# Altium schematic sheet Buck_Converter.SchDoc
size A4
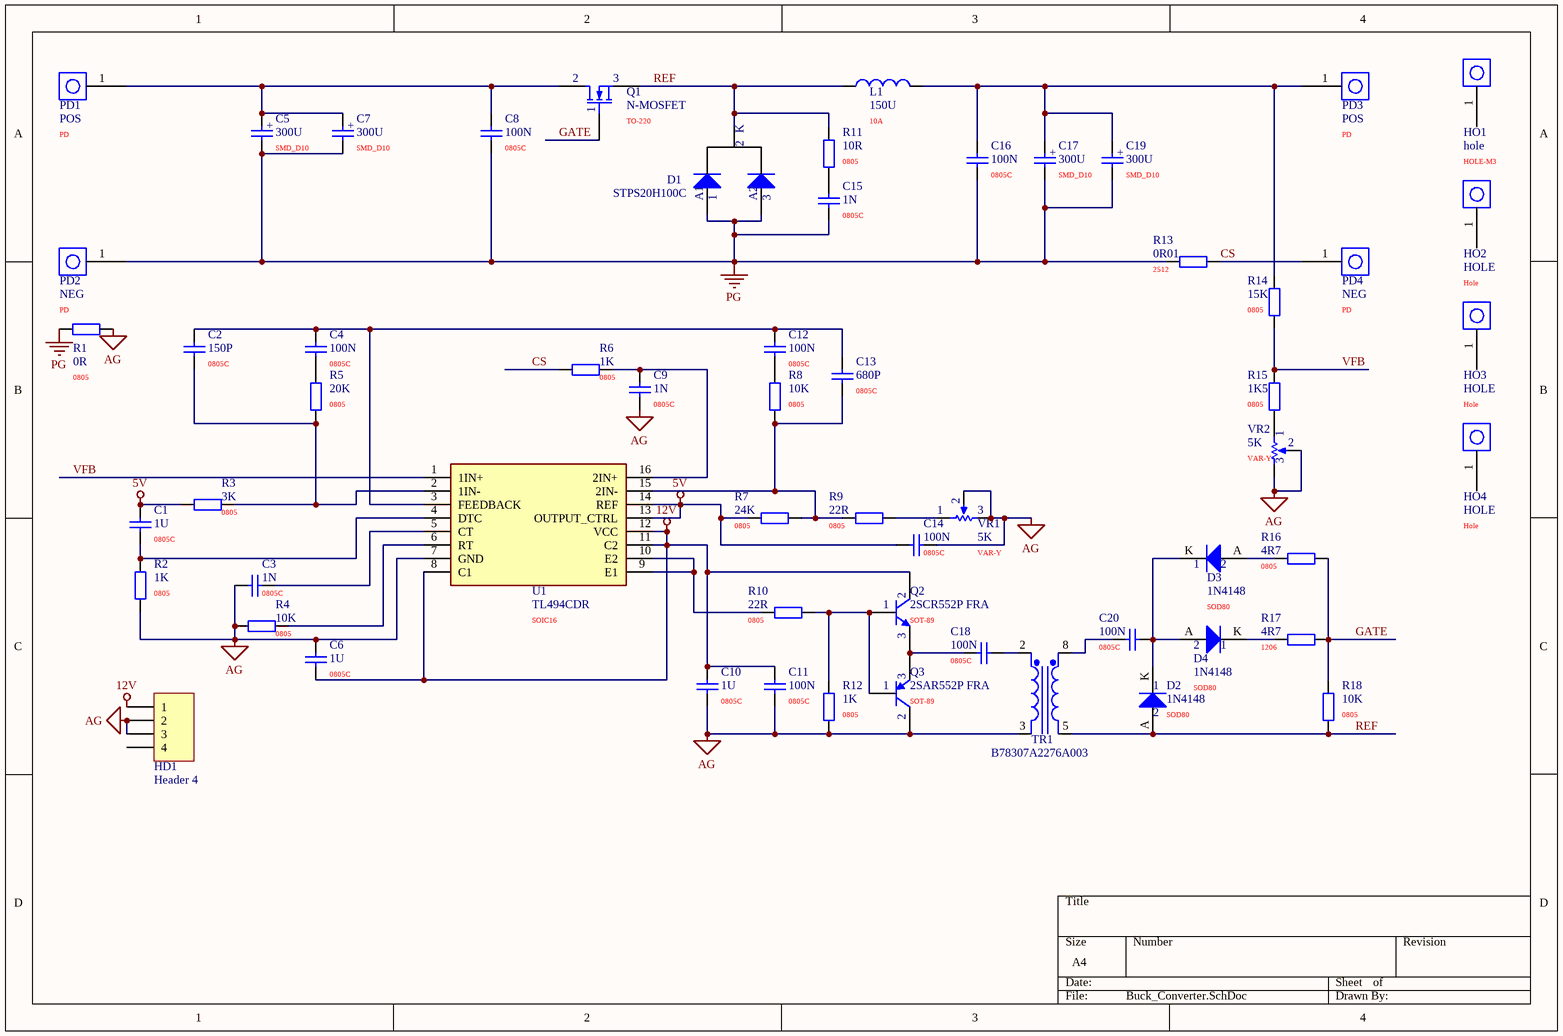
[diagram p0: Buck_Converter.SchDoc]

## Parts
C1  1uF  [Capacitors_SMD_0805]  (value not drawn)
C2  150pF  [Capacitors_SMD_0805]  (value not drawn)
C3  1nF  [Capacitors_SMD_0805]  (value not drawn)
C4  100nF  [Capacitors_SMD_0805]  (value not drawn)
C5  330uf  [Capacitors_SMD_D10]  (value not drawn)
C6  1uF  [Capacitors_SMD_0805]  (value not drawn)
C7  330uf  [Capacitors_SMD_D10]  (value not drawn)
C8  100nF  [Capacitors_SMD_0805]  (value not drawn)
C9  1nF  [Capacitors_SMD_0805]  (value not drawn)
C10  1uF  [Capacitors_SMD_0805]  (value not drawn)
C11  100nF  [Capacitors_SMD_0805]  (value not drawn)
C12  100nF  [Capacitors_SMD_0805]  (value not drawn)
C13  680pF  [Capacitors_SMD_0805]  (value not drawn)
C14  100nF  [Capacitors_SMD_0805]  (value not drawn)
C15  1nF  [Capacitors_SMD_0805]  (value not drawn)
C16  100nF  [Capacitors_SMD_0805]  (value not drawn)
C17  330uF  [Capacitors_SMD_D10]  (value not drawn)
C18  100nF  [Capacitors_SMD_0805]  (value not drawn)
C19  330uF  [Capacitors_SMD_D10]  (value not drawn)
C20  100nF  [Capacitors_SMD_0805]  (value not drawn)
D1  STPS20H100C  [TO-220_Diode]  (value not drawn)
D2  1N4148  [1N4148]  (value not drawn)
D3  1N4148  [1N4148]  (value not drawn)
D4  1N4148  [1N4148]  (value not drawn)
HD1  Header 4  [HDR1X4]
HO1  HOLE  [Hole]  (value not drawn)
HO2  HOLE  [Hole]  (value not drawn)
HO3  HOLE  [Hole]  (value not drawn)
HO4  HOLE  [Hole]  (value not drawn)
L1  Inductor  [Inductor]  (value not drawn)
PD1  Terminal  [Terminal]  (value not drawn)
PD2  Terminal  [Terminal]  (value not drawn)
PD3  Terminal  [Terminal]  (value not drawn)
PD4  Terminal  [Terminal]  (value not drawn)
Q1  N-MOSFET  [TO-220)N-MOSFET]  (value not drawn)
Q2  2SCR552P  [2SCR552P]  (value not drawn)
Q3  2SAR552P  [2SAR552P]  (value not drawn)
R1  0R  [RESISTOR_SMD_0805]  (value not drawn)
R2  1K  [RESISTOR_SMD_0805]  (value not drawn)
R3  3K  [RESISTOR_SMD_0805]  (value not drawn)
R4  10K  [RESISTOR_SMD_0805]  (value not drawn)
R5  20K  [RESISTOR_SMD_0805]  (value not drawn)
R6  1K  [RESISTOR_SMD_0805]  (value not drawn)
R7  24K  [RESISTOR_SMD_0805]  (value not drawn)
R8  10K  [RESISTOR_SMD_0805]  (value not drawn)
R9  22R  [RESISTOR_SMD_0805]  (value not drawn)
R10  22R  [RESISTOR_SMD_0805]  (value not drawn)
R11  10R  [RESISTOR_SMD_0805]  (value not drawn)
R12  1K  [RESISTOR_SMD_0805]  (value not drawn)
R13  0R01  [RESISTOR_SMD_2512]  (value not drawn)
R14  15K  [RESISTOR_SMD_0805]  (value not drawn)
R15  1K5  [RESISTOR_SMD_0805]  (value not drawn)
R16  4R7  [RESISTOR_SMD_0805]  (value not drawn)
R17  4R7  [RESISTOR_SMD_1206]  (value not drawn)
R18  10K  [RESISTOR_SMD_0805]  (value not drawn)
TL494CDR  TL494CDR  [TL494CDR]  (value not drawn)
TR1  B78307A2276A003  [B78307A2276A003]  (value not drawn)
VR1  5K  [Baoter_3296]  (value not drawn)
VR2  5K  [Baoter_3296]  (value not drawn)

## Nets
5V: C1.2 C14.1 R3.1 R7.1 TL494CDR.13(OUTPUT_CTRL) TL494CDR.14(REF)
12V: C6.2 C10.2 C11.2 HD1.1 Q2.2(C) TL494CDR.8(C1) TL494CDR.11(C2) TL494CDR.12(VCC)
AG: C3.1 C6.1 C9.1 C10.1 C11.1 C14.2 HD1.2 HD1.3 Q3.2(C) R1.2 R2.1 R4.1 R12.1 TL494CDR.7(GND) TR1.3(Pri-) VR1.2(TAP) VR1.3(TOP) VR2.2(TAP) VR2.3(TOP)
PG: C5.2 C7.2 C8.2 C15.2 C16.1 C17.2 C19.2 D1.A1 D1.A2 PD2.1 R1.1 R13.1
CS: PD4.1 R6.1 R13.2
GATE: Q1.1(G) R16.2 R17.2 R18.2
REF: D1.K D2.A L1.1 Q1.3(S) R11.2 R18.1 TR1.5(Sec-)
VFB: R14.1 R15.2 TL494CDR.1(1IN+)
NetC1_1: C1.1 R2.2 TL494CDR.4(DTC)
NetC2_1: C2.1 R3.2 R5.2 TL494CDR.2(1IN-)
NetC2_2: C2.2 C4.2 C12.2 C13.1 TL494CDR.3(FEEDBACK)
NetC3_2: C3.2 TL494CDR.5(CT)
NetC4_1: C4.1 R5.1
NetC5_1: C5.1 C7.1 C8.1 PD1.1 Q1.2(D)
NetC9_2: C9.2 R6.2 TL494CDR.16(2IN+)
NetC12_1: C12.1 R8.2
NetC13_2: C13.2 R7.2 R8.1 R9.1 TL494CDR.15(2IN-)
NetC15_1: C15.1 R11.1
NetC16_2: C16.2 C17.1 C19.1 L1.2 PD3.1 R14.2
NetC18_1: C18.1 Q2.3(E) Q3.3(E)
NetC18_2: C18.2 TR1.2(Pri+)
NetC20_1: C20.1 TR1.8(Sec+)
NetC20_2: C20.2 D2.K D3.K D4.A
NetD3_A: D3.A R16.1
NetD4_K: D4.K R17.1
NetQ2_1: Q2.1(B) Q3.1(B) R10.2 R12.2
NetR4_2: R4.2 TL494CDR.6(RT)
NetR9_2: R9.2 VR1.1(BOT)
NetR10_1: R10.1 TL494CDR.9(E1) TL494CDR.10(E2)
NetR15_1: R15.1 VR2.1(BOT)

Not connected (* = marked no-connect by the designer): HD1 4; HO1 1; HO2 1; HO3 1; HO4 1

## Notes on the sheet
- (in symbol C1) 1U; 0805C
- (in symbol C2) 150P; 0805C
- (in symbol C3) 1N; 0805C
- (in symbol C4) 100N; 0805C
- (in symbol C5) +; 300U
- (in symbol C6) 1U; 0805C
- (in symbol C7) +; 300U
- (in symbol C8) 100N; 0805C
- (in symbol C9) 1N; 0805C
- (in symbol C10) 1U; 0805C
- (in symbol C11) 100N; 0805C
- (in symbol C12) 100N; 0805C
- (in symbol C13) 680P; 0805C
- (in symbol C14) 100N; 0805C
- (in symbol C15) 1N; 0805C
- (in symbol C16) 100N; 0805C
- (in symbol C17) +; 300U
- (in symbol C18) 100N; 0805C
- (in symbol C19) +; 300U
- (in symbol C20) 100N; 0805C
- (in symbol D1) 2; 1; 3
- (in symbol D2) 1; 2; SOD80
- (in symbol D3) 1; 2; SOD80
- (in symbol D4) 2; 1; SOD80
- (in symbol HO1) hole; HOLE-M3
- (in symbol HO2) Hole
- (in symbol HO3) Hole
- (in symbol HO4) Hole
- (in symbol L1) 150U; 10A
- (in symbol PD1) POS; PD
- (in symbol PD2) NEG; PD
- (in symbol PD3) POS; PD
- (in symbol PD4) NEG; PD
- (in symbol Q1) TO-220
- (in symbol Q2) 2SCR552P FRA; SOT-89
- (in symbol Q3) 2SAR552P FRA; SOT-89
- (in symbol R1) 0805
- (in symbol R2) 0805
- (in symbol R3) 0805
- (in symbol R4) 0805
- (in symbol R5) 0805
- (in symbol R6) 0805
- (in symbol R7) 0805
- (in symbol R8) 0805
- (in symbol R9) 0805
- (in symbol R10) 0805
- (in symbol R11) 0805
- (in symbol R12) 0805
- (in symbol R13) 2512
- (in symbol R14) 0805
- (in symbol R15) 0805
- (in symbol R16) 0805
- (in symbol R17) 1206
- (in symbol R18) 0805
- (in symbol TL494CDR) U1; SOIC16
- (in symbol VR1) VAR-Y
- (in symbol VR2) VAR-Y

## Library data of the parts
C1 = C1: SMD_0805
C2 = C2: SMD_0805
C3 = C3: SMD_0805
C4 = C4: SMD_0805
C5 = C5: SMD_D10
C6 = C6: SMD_0805
C7 = C7: SMD_D10
C8 = C8: SMD_0805
C9 = C9: SMD_0805
C10 = C10: SMD_0805
C11 = C11: SMD_0805
C12 = C12: SMD_0805
C13 = C13: SMD_0805
C14 = C14: SMD_0805
C15 = C15: SMD_0805
C16 = C16: SMD_0805
C17 = C17: SMD_D10
C18 = C18: SMD_0805
C19 = C19: SMD_D10
C20 = C20: SMD_0805
D1 = D1: Schottky
D2 = D2: Diode
D3 = D3: Diode
D4 = D4: Diode
HD1 = Header 4: Header, 4-Pin; LatestRevisionDate: 17-Jul-2002; LatestRevisionNote: Re-released for DXP Platform.; Publisher: Altium Limited
HO1 = HO1
HO2 = HO2
HO3 = HO3
HO4 = HO4
L1 = L1
PD1 = PD1
PD2 = PD2
PD3 = PD3
PD4 = PD4
Q1 = Q1
Q2 = Q2: NPN-BJT
Q3 = Q3: PNP-BJT
R1 = R1: SMD_0805
R2 = R2: SMD_0805
R3 = R3: SMD_0805
R4 = R4: SMD_0805
R5 = R5: SMD_0805
R6 = R6: SMD_0805
R7 = R7: SMD_0805
R8 = R8: SMD_0805
R9 = R9: SMD_0805
R10 = R10: SMD_0805
R11 = R11: SMD_0805
R12 = R12: SMD_0805
R13 = R13: SMD_2512
R14 = R14: SMD_0805
R15 = R15: SMD_0805
R16 = R16: SMD_0805
R17 = R17: SMD_1206
R18 = R18: SMD_0805
TL494CDR = TL494CDR: PWM_controller
TR1 = TR1: SMDTransformers
VR1 = VR1: Baoter_3296
VR2 = VR2: Baoter_3296